# Altium schematic sheet 24Vto320V.SchDoc
size 863 x 558 mm; SheetNumber: 2; SheetTotal: 3
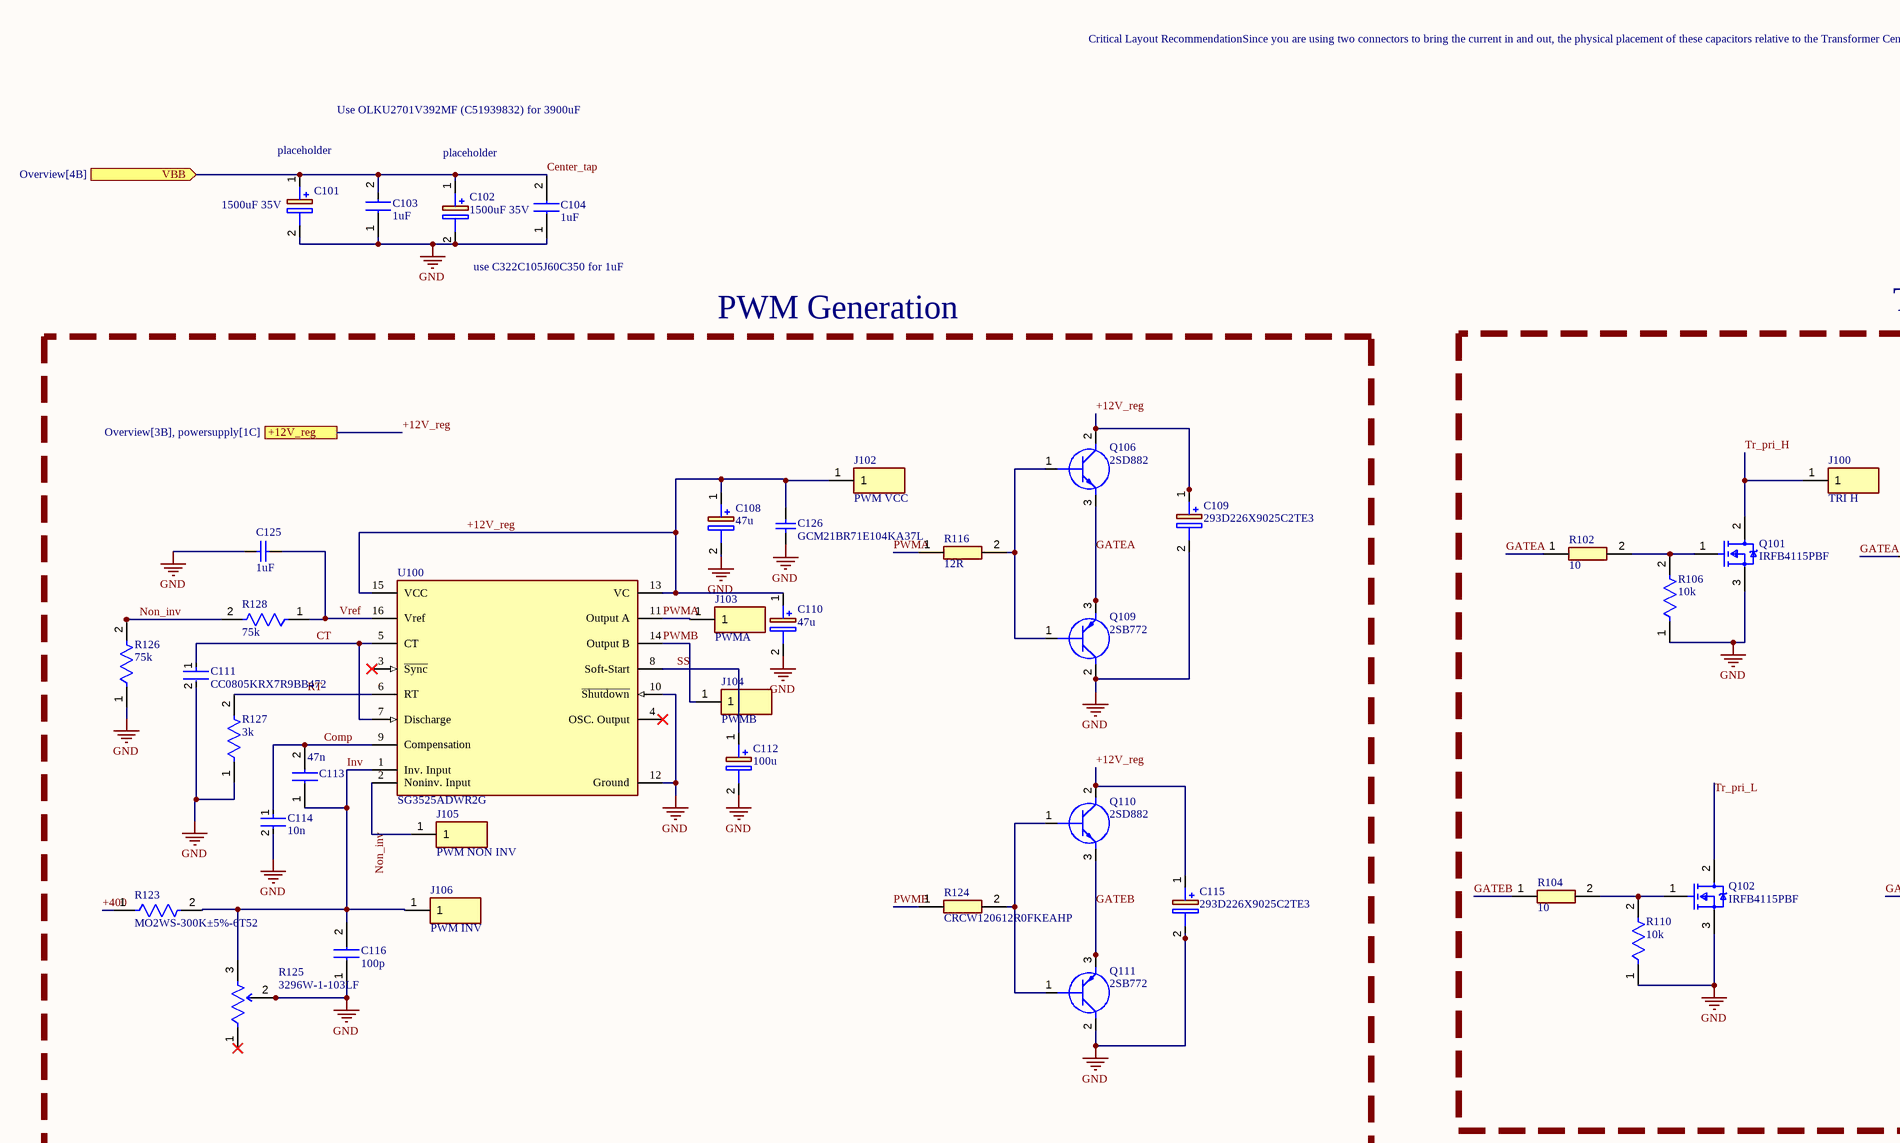
[diagram p0: 24Vto320V.SchDoc, top left]
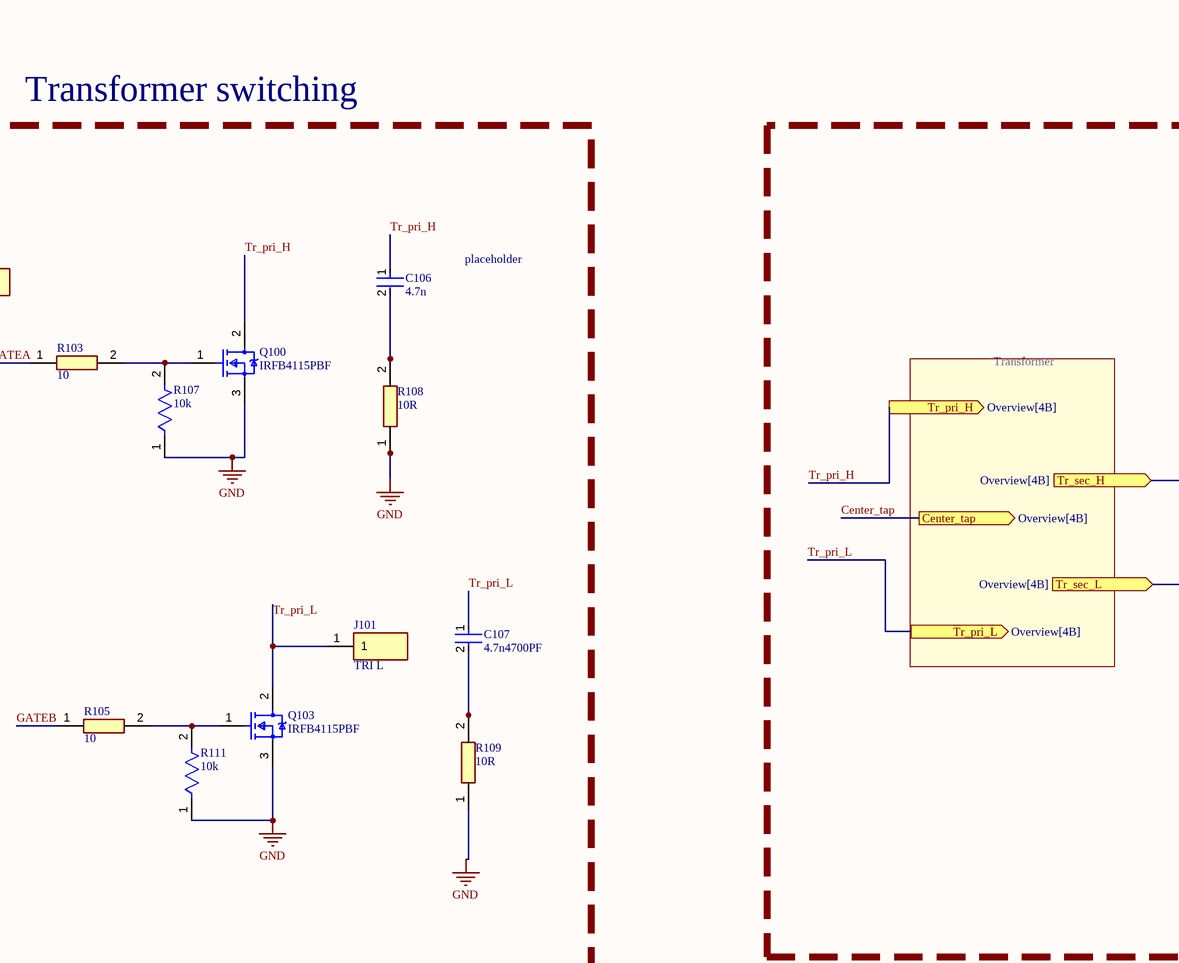
[diagram p1: 24Vto320V.SchDoc, top middle]
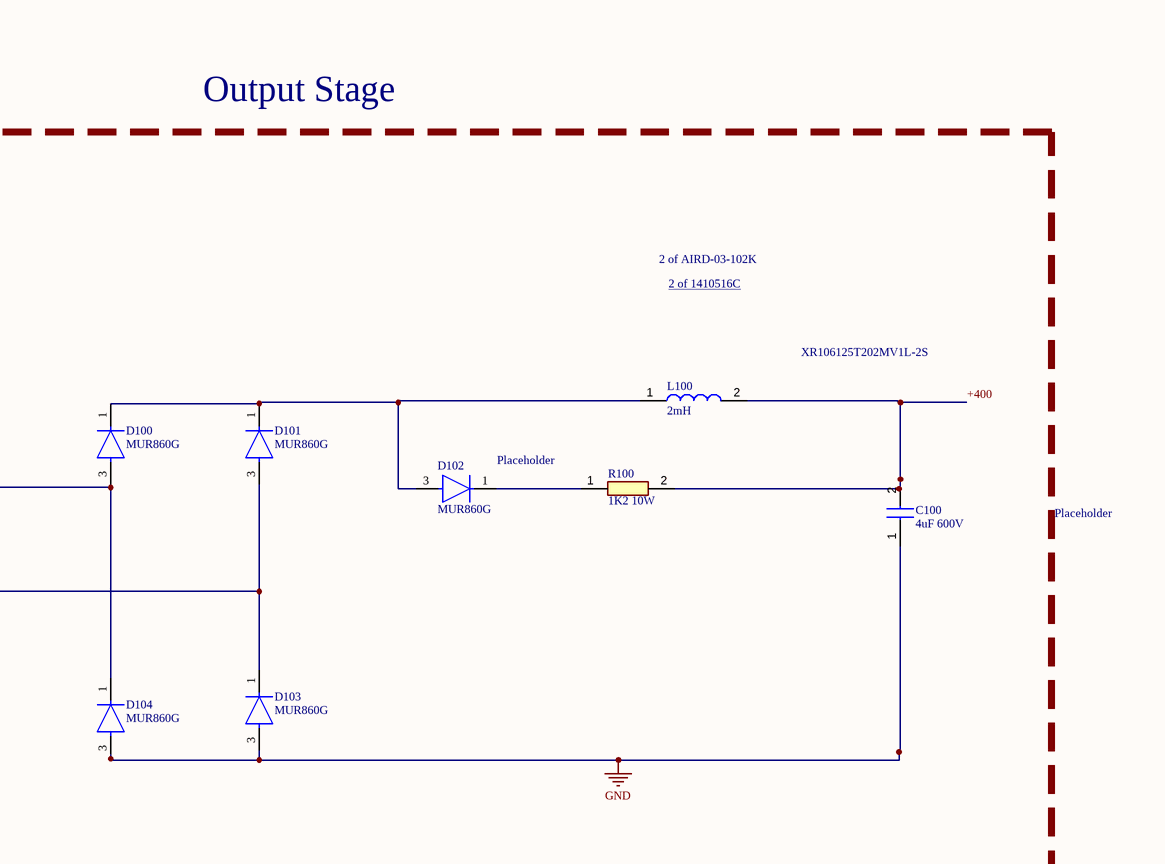
[diagram p2: 24Vto320V.SchDoc, top right]
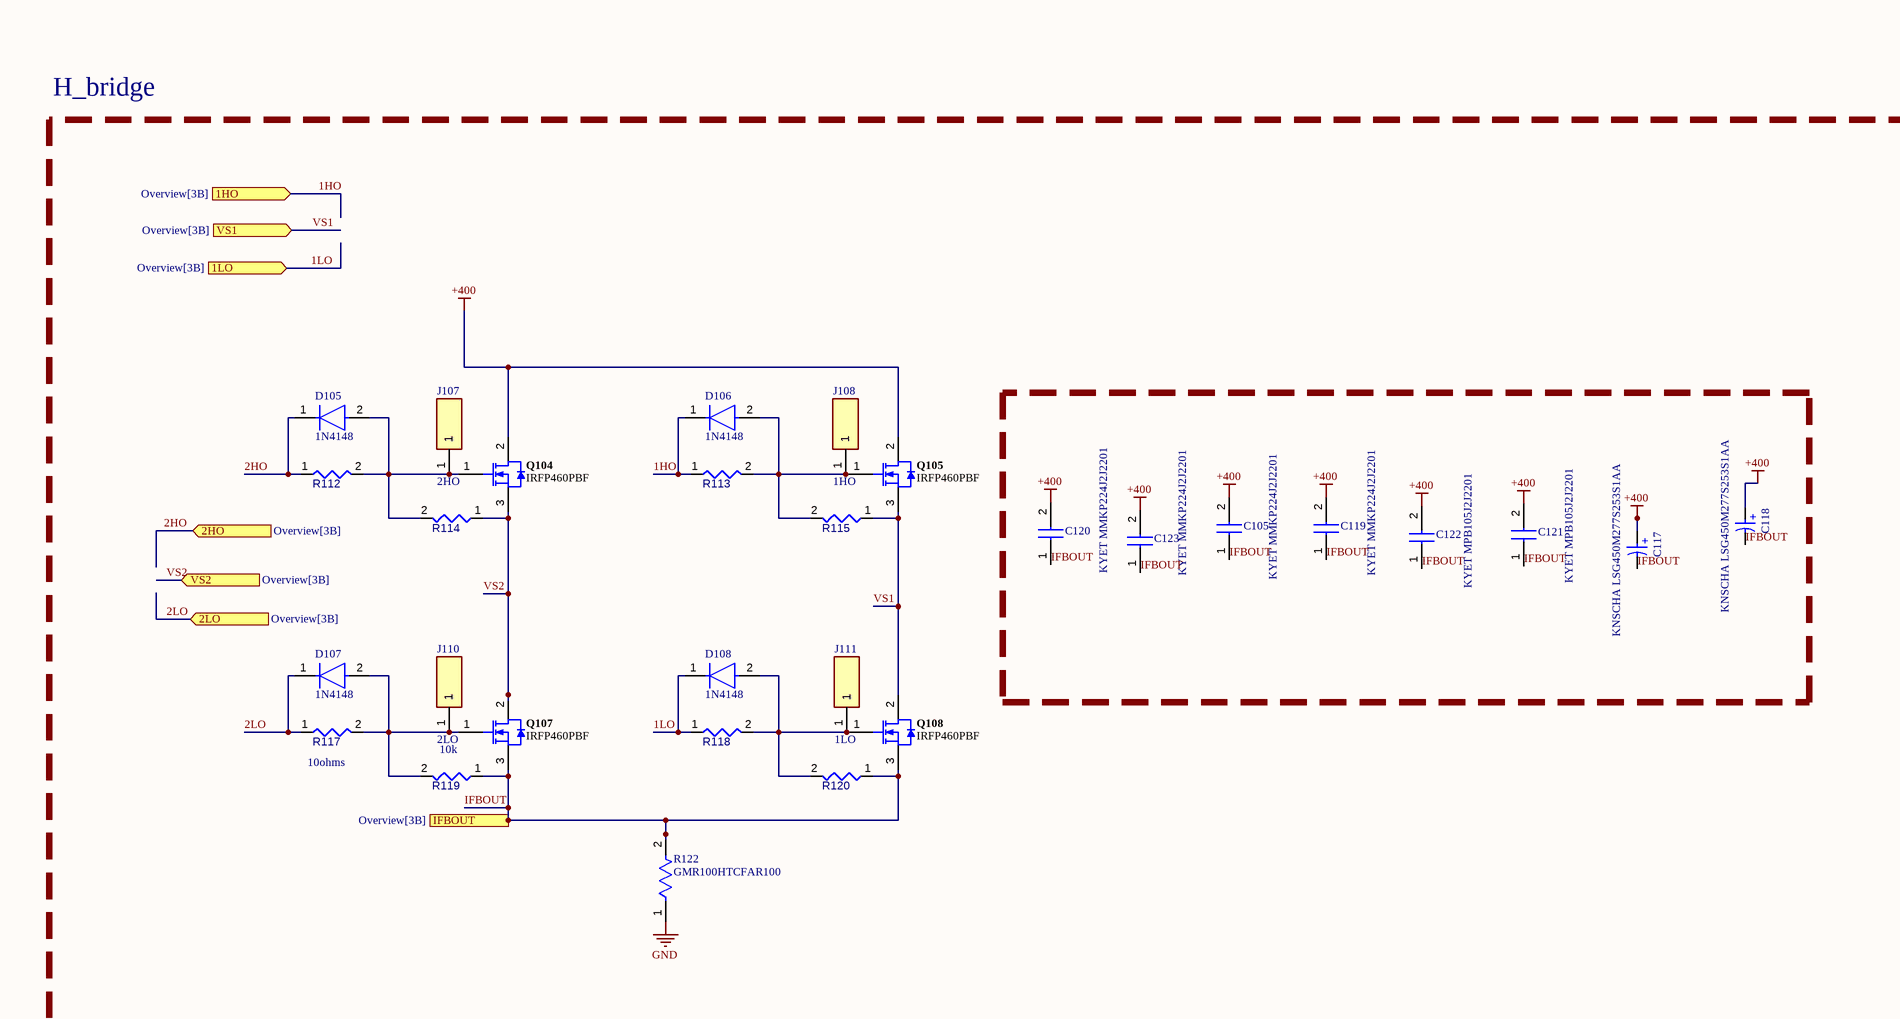
[diagram p3: 24Vto320V.SchDoc, bottom left]
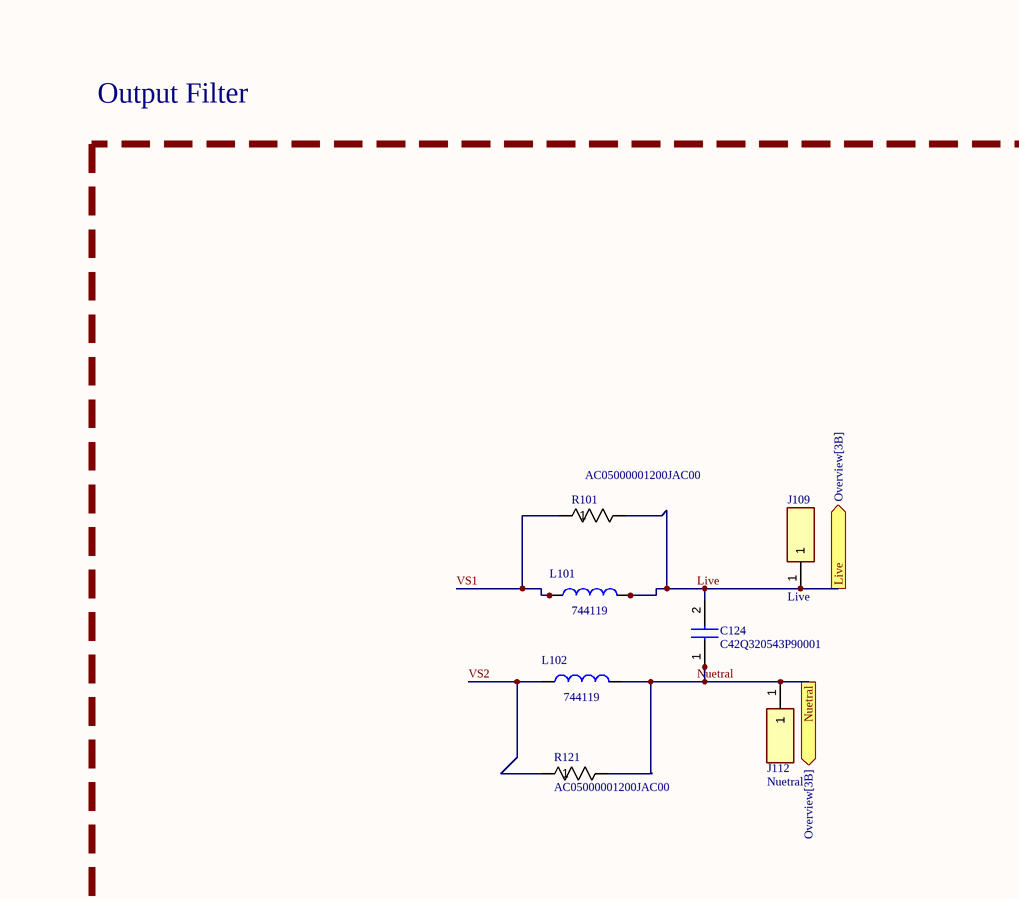
[diagram p4: 24Vto320V.SchDoc, bottom middle]

## Parts
C100  4uF 600V  [ECWFE2J225P5]
C101  1500uF 35V  [CAPPRD750W85D1800H2200]
C102  1500uF 35V  [CAPPRD750W85D1800H2200]
C103  1uF  [R75IN41004040J]
C104  1uF  [R75IN41004040J]
C105  KYET MMKP224J2J2201  [222233915224]
C106  4.7n  [FP-C1206C-EB-MFG]
C107  4.7n4700PF  [FP-C1206C-EB-MFG]
C108  47u  [CAPPRD250W55D655H1220]
C109  293D226X9025C2TE3  [CAPPM6032X280N]
C110  47u  [CAPPRD250W55D655H1220]
C111  CC0805KRX7R9BB472  [FP-CC0805-0_85-MFG]
C112  100u  [EEE0JA331XP]
C113  47n  [CAPC2012X145N]
C114  10n  [FP-CC0805-0_85-MFG]
C115  293D226X9025C2TE3  [CAPPM6032X280N]
C116  100p  [CAPC3216X88N]
C117  KNSCHA LSG450M277S253S1AA  [WCAP-AIG8_D30H30]
C118  KNSCHA LSG450M277S253S1AA  [WCAP-AIG8_D30H30]
C119  KYET MMKP224J2J2201  [222233915224]
C120  KYET MMKP224J2J2201  [222233915224]
C121  KYET MPB105J2J2201  [222233915224]
C122  KYET MPB105J2J2201  [222233915224]
C123  KYET MMKP224J2J2201  [222233915224]
C124  C42Q320543P90001  [222233915224]
C125  1uF  [CAPC2013X140X50LL20T25]
C126  GCM21BR71E104KA37L  [CAPC2013X140X45LL15T25]
D100  MUR860G  [FP-221B-04-MFG]
D101  MUR860G  [FP-221B-04-MFG]
D102  MUR860G  [FP-221B-04-MFG]
D103  MUR860G  [FP-221B-04-MFG]
D104  MUR860G  [FP-221B-04-MFG]
D105  1N4148  [FP-017AG-MFG]
D106  1N4148  [FP-017AG-MFG]
D107  1N4148  [FP-017AG-MFG]
D108  1N4148  [FP-017AG-MFG]
J100  TRI H  [5000]
J101  TRI L  [5000]
J102  PWM VCC  [5000]
J103  PWMA  [5000]
J104  PWMB  [5000]
J105  PWM NON INV  [5000]
J106  PWM INV  [5000]
J107  2HO  [5000]
J108  1HO  [5000]
J109  Live  [5000]
J110  2LO  [5000]
J111  1LO  [5000]
J112  Nuetral  [5000]
L100  2mH  [2300LL102VRC]
L101  744119  [744119]
L102  744119  [744119]
Q100  IRFB4115PBF  [FP-PG-TO220-3-MFG]
Q101  IRFB4115PBF  [FP-PG-TO220-3-MFG]
Q102  IRFB4115PBF  [FP-PG-TO220-3-MFG]
Q103  IRFB4115PBF  [FP-PG-TO220-3-MFG]
Q104  IRFP460PBF  [VISH-TO-247AC-3]
Q105  IRFP460PBF  [VISH-TO-247AC-3]
Q106  2SD882  [BD235]
Q107  IRFP460PBF  [VISH-TO-247AC-3]
Q108  IRFP460PBF  [VISH-TO-247AC-3]
Q109  2SB772  [TO229P290X760X1320-3P]
Q110  2SD882  [BD235]
Q111  2SB772  [TO229P290X760X1320-3P]
R100  1K2 10W  [SQP10AJB100R]
R101  AC05000001200JAC00  [RES_AC05_VIS]
R102  10  [RESC3216X60N]
R103  10  [RESC3216X60N]
R104  10  [RESC3216X60N]
R105  10  [RESC3216X60N]
R106  10k  [FP-CRCW0805-e3-IPC_A]
R107  10k  [FP-CRCW0805-e3-IPC_A]
R108  10R  [RESC6332X70N]
R109  10R  [RESC6332X70N]
R110  10k  [FP-CRCW0805-e3-IPC_A]
R111  10k  [FP-CRCW0805-e3-IPC_A]
R112  4.7 Ohm  [RESC0805(2012)_L]  (value not drawn)
R113  4.7 Ohm  [RESC0805(2012)_L]  (value not drawn)
R114  Resistor 10k +/-1% 0805 125 mW  [RESC2013X50X35ML15T15]  (value not drawn)
R115  Resistor 10k +/-1% 0805 125 mW  [RESC2013X50X35ML15T15]  (value not drawn)
R116  12R  [RESC3116X65N]
R117  4.7 Ohm  [RESC0805(2012)_L]  (value not drawn)
R118  4.7 Ohm  [RESC0805(2012)_L]  (value not drawn)
R119  Resistor 10k +/-1% 0805 125 mW  [RESC2013X50X35ML15T15]  (value not drawn)
R120  Resistor 10k +/-1% 0805 125 mW  [RESC2013X50X35ML15T15]  (value not drawn)
R121  AC05000001200JAC00  [RES_AC05_VIS]
R122  GMR100HTCFAR100  [FP-GMR100-MFG]
R123  MO2WS-300K±5%-6T52  [FP-VR37-MFG]
R124  CRCW120612R0FKEAHP  [RESC3116X65N]
R125  3296W-1-103LF  [FP-3296W-MFG]
R126  75k  [FP-CRCW0805-e3-IPC_A]
R127  3k  [FP-CRCW0805-e3-IPC_C]
R128  75k  [FP-CRCW0805-e3-IPC_A]
U100  SG3525ADWR2G  [FP-751G-MFG]

## Blocks framed on the sheet
PWM Generation: C108-C116 C125 C126 J102-J106 Q106 Q109-Q111 R116 R123-R128 U100
Transformer switching: C106 C107 J100 J101 Q100-Q103 R102-R111
H_bridge: C105 C117-C123 D105-D108 J107 J108 J110 J111 Q104 Q105 Q107 Q108 R112-R115 R117-R120 R122

## Ports
1HO (in, see Overview[3B]), 1LO (in, see Overview[3B]), 2HO (in, see Overview[3B]), 2LO (in, see Overview[3B]), +12V_reg (see Overview[3B], powersupply[1C]), Center_tap (out, see Overview[4B]), IFBOUT (out, see Overview[3B]), Live (out, see Overview[3B]), Nuetral (out, see Overview[3B]), Tr_pri_H (out, see Overview[4B]), Tr_pri_L (out, see Overview[4B]), Tr_sec_H (in, see Overview[4B]), Tr_sec_L (in, see Overview[4B]), VBB (in, see Overview[4B]), VS1 (in, see Overview[3B]), VS2 (in, see Overview[3B])

## Nets
+400: C100.2 C105.2 C117.1(P) C118.1(P) C119.2 C120.2 C121.2 C122.2 C123.2 L100.2 Q104.2(D) Q105.2(D) R100.2 R123.1
GND: C100.1 C101.2(-) C102.2(-) C103.1 C104.1 C108.2(-) C109.2(-) C110.2(-) C111.2 C112.2(-) C114.2 C115.2(-) C116.1 C125.2 C126.1 D103.3(A) D104.3(A) Q100.3(S) Q101.3(S) Q102.3(S) Q103.3(S) Q109.2(C) Q111.2(C) R106.1 R107.1 R108.1 R109.1 R110.1 R111.1 R122.1 R125.2(WIPER) R126.1 R127.1 U100.10(~{Shutdown}) U100.12(Ground)
1HO: D106.1(C) R113.1 ; port 1HO
1LO: D108.1(C) R118.1 ; port 1LO
2HO: D105.1(C) R112.1 ; port 2HO
2LO: D107.1(C) R117.1 ; port 2LO
+12V_reg: C108.1(+) C109.1(+) C110.1(+) C115.1(+) C126.2 J102.1 Q106.2(C) Q110.2(C) U100.13(VC) U100.15(VCC) ; port +12V_reg
Center_tap: C101.1(+) C102.1(+) C103.2 C104.2 ; port VBB, port Center_tap
Comp: C113.2 C114.1 U100.9(Compensation)
CT: C111.1 U100.5(CT) U100.7(Discharge)
GATEA: Q106.3(E) Q109.3(E) R102.1 R103.1
GATEB: Q110.3(E) Q111.3(E) R104.1 R105.1
IFBOUT: C105.1 C117.2(N) C118.2(N) C119.1 C120.1 C121.1 C122.1 C123.1 Q107.3(S) Q108.3(S) R119.1 R120.1 R122.2 ; port IFBOUT
Inv: C113.1 C116.2 J106.1 R123.2 R125.3(CW) U100.1(Inv._Input)
Live: C124.2 J109.1 L101.2 R101.2 ; port Live
Non_inv: J105.1 R126.2 R128.2 U100.2(Noninv._Input)
Nuetral: C124.1 J112.1 L102.2 R121.2 ; port Nuetral
PWMA: J103.1 R116.1 U100.11(Output_A)
PWMB: J104.1 R124.1 U100.14(Output_B)
RT: R127.2 U100.6(RT)
SS: C112.1(+) U100.8(Soft-Start)
Tr_pri_H: C106.1 J100.1 Q100.2(D) Q101.2(D) ; port Tr_pri_H
Tr_pri_L: C107.1 J101.1 Q102.2(D) Q103.2(D) ; port Tr_pri_L
Tr_sec_H: D100.3(A) D104.1(C) ; port Tr_sec_H
Tr_sec_L: D101.3(A) D103.1(C) ; port Tr_sec_L
Vref: C125.1 R128.1 U100.16(Vref)
VS1: L101.1 Q105.3(S) Q108.2(D) R101.1 R115.1 ; port VS1
VS2: L102.1 Q104.3(S) Q107.2(D) R114.1 R121.1 ; port VS2
NetC106_2: C106.2 R108.2
NetC107_2: C107.2 R109.2
NetD100_1: D100.1(C) D101.1(C) D102.3(A) L100.1
NetD102_1: D102.1(C) R100.1
NetD105_2: D105.2(A) J107.1 Q104.1(G) R112.2 R114.2
NetD106_2: D106.2(A) J108.1 Q105.1(G) R113.2 R115.2
NetD107_2: D107.2(A) J110.1 Q107.1(G) R117.2 R119.2
NetD108_2: D108.2(A) J111.1 Q108.1(G) R118.2 R120.2
NetQ100_1: Q100.1(G) R103.2 R107.2
NetQ101_1: Q101.1(G) R102.2 R106.2
NetQ102_1: Q102.1(G) R104.2 R110.2
NetQ103_1: Q103.1(G) R105.2 R111.2
NetQ106_1: Q106.1(B) Q109.1(B) R116.2
NetQ110_1: Q110.1(B) Q111.1(B) R124.2

Not connected (* = marked no-connect by the designer): R125 1(CCW)*; U100 3(~{Sync})* 4(OSC._Output)*

## Notes on the sheet
- Critical Layout RecommendationSince you are using two connectors to bring the current in and out, the physical placement of these capacitors relative to the Transformer Center Tap and the MOSFET Sources is everything.1. The "Star" ConnectionDo not just connect the ground of these capacitors to a random spot on the board.Positive Side: Place the capacitors as close as possible to the +12V pins of your 38969-0002 connector.Negative Side: The ground lead of these capacitors should be the central "Star Ground" point. The Sources of your push-pull MOSFETs should connect directly to this point with the widest possible traces.2. High-Frequency Cap PlacementWhile the $3900\mu\text{F}$ caps can be a few centimeters away, the $1\mu\text{F}$ capacitors (C103, C104) should be soldered as close to the MOSFET Drains and the Transformer Center Tap as humanly possible. This minimizes the loop area, which reduces the voltage spikes that can kill your MOSFETs.What’s Missing? (Recommendations)To make this 500W setup truly robust, consider these two additions:Small Ceramic Caps ($100\text{nF}$): Add a $100\text{nF}$ (0.1$\mu\text{F}$) X7R ceramic capacitor in parallel with each $1\mu\text{F}$ cap. Ceramics have even lower ESL and handle the nanosecond-scale ringing better than film caps.Fuse: At 500W from 12V, you are pulling over 40A. A 60A automotive bolt-down fuse (MIDI or MEGA fuse) should be placed between the battery and $V_{BB}$. If a MOSFET fails short-circuit (which is common during testing), your traces will vaporize without a fuse.Pro-tip for your EE55 build: Since you mentioned the transformer is external, the inductance of the wires connecting to the center tap will fight the capacitors. Try to keep the $V_{BB}$ line and the Ground line twisted together as they travel to the transformer to minimize that "stray" inductance.
- Use OLKU2701V392MF (C51939832) for 3900uF
- (near C101) placeholder
- (near C102) placeholder
- use C322C105J60C350 for 1uF
- Output Stage
- placeholder
- 2 of AIRD-03-102K
- 2 of 1410516C <https://www.mouser.com/datasheet/3/76/3/kmp_1400.pdf>
- XR106125T202MV1L-2S
- Transformer
- Placeholder
- Output Filter
- (near R117) 10ohms
- 10k
- DWG. NO.
- REV.
- SHT.
- REVISION
- DESCRIPTION
- DATE
- APPROVED
- THIS DOCUMENT AND THE DATA DISCLOSED HEREIN OR HEREWITH IS THE PROPERTY OF ALTIUM LIMITED AND MAY BE FREELY DISTRIBUTED IN WHOLE. NO RIGHTS ARE RESERVED OR EXPRESS OR IMPLIED WARANTEE GIVEN.
- ENG:
- DSN:
- APPROVALS
- PROJECT
- DOCUMENT REVISION:
- DESIGN ITEM:
- CHK:
- BOM:
- REFERENCE DOCUMENTS
- PROJECT REVISION:
- TITLE
- FAB DWG:
- PCB DWG:
- ASSY DWG:
- SCALE:
- SIZE
- D
- CAGE CODE
- FILE NAME
- DWG NO.
- SHEET
- OF
- REV
- (in symbol CMP-03913-54202287-2) +

## Library data of the parts
C100 = ECW-FE2J225P5: C3D1U405KB00C00; Manufacturer_Name: Panasonic; Datasheet Link: https://industrial.panasonic.com/cdbs/www-data/pdf/RDI0000/ABD0000C202.pdf; Height: 23.5mm; Manufacturer_Part_Number: ECW-FE2J225P5
C101 C102 = EEU-FC1V152S: 35ZLH1500MEFC12.5X30; Manufacturer_Name: Panasonic; Datasheet Link: http://industrial.panasonic.com/cdbs/www-data/pdf/RDF0000/ABA0000C1209.pdf; Height: 22mm; Manufacturer_Part_Number: EEU-FC1V152S; Mouser Part Number: 667-EEU-FC1V152S; Mouser Price/Stock: https://www.mouser.com/Search/Refine.aspx?Keyword=667-EEU-FC1V152S; Arrow Part Number: EEU-FC1V152S; Arrow Price/Stock: https://www.arrow.com/en/products/eeu-fc1v152s/panasonic
C103 C104 = R75IN41004040J: C322C105J60C350; Manufacturer_Name: Yageo Group; Datasheet Link: https://www.yageogroup.com/content/datasheet/asset/file/KEM_F3106_R75; Height: 16mm; Manufacturer_Part_Number: R75IN41004040J; Mouser Part Number: 80-R75IN41004040J; Mouser Price/Stock: https://www.mouser.co.uk/ProductDetail/KEMET/R75IN41004040J?qs=pfd5qewlna63QSQqVCHX%2Fw%3D%3D
C105 C119 C120 C123 = 222233915224: 220nF Film Capacitor ±5% 630V Through Hole P=22.5mm; Manufacturer_Name: Vishay; Datasheet Link: https://www.vishay.com/docs/28138/mkp339x2.pdf; Height: 15.5mm; Manufacturer_Part_Number: 222233915224; Mouser Part Number: N/A; Mouser Price/Stock: https://www.mouser.co.uk/ProductDetail/Vishay-BC-Components/222233915224?qs=vkgpMzy1B9Fp9IMdtZOLlw%3D%3D
C106 C107 = CMP-03020-021254-1: CAP CER 4700PF 100V 10% X7R 1206 / CC1206KRX7R0BB472; Manufacturer Part Number: C1206C472K1RACTU; Manufacturer: KEMET; Value: 4,700 pF; Tolerance: 0.1; Temperature Coefficient: 15%; Material: Ceramic; Automotive Grade: Grade 0; ComponentLink2Description: Datasheet; Mouser Description: 1206 4.7nF Ceramic Multilayer Capacitor; 100V dc; 125C; X7R Dielectric; +/-10% SMD; Lead Free: Yes; Automotive: Yes; Category: Cap; Package: C1206C-EB; RoHS: TRUE; Digikey Description: CAP CER 4700PF 100V 10% X7R 1206; Ipc Land Pattern Name: CAPC320160X78; Voltage Rating: 100 V; Temperature Range High: +150°C; Temperature Characteristic: X7R; Octopart: https://octopart.com/c1206c472k1ractu-kemet-3865440; Temperature: -55°C to +150°C; Device Class L2: Capacitors; Device Class L3: Ceramic Capacitors; ComponentLink2URL: https://content.kemet.com/datasheets/KEM_C1007_X8R_ULTRA_150C_SMD.pdf; Capacitance: 4,700 pF; Temperature Range Low: -55°C; Device Class L1: Passive Components; Height: 0.88mm
C108 C110 = EEU-FC1V470: Manufacturer_Name: Panasonic; Datasheet Link: http://industrial.panasonic.com/cdbs/www-data/pdf/RDF0000/ABA0000C1209.pdf; Height: 12.2mm; Manufacturer_Part_Number: EEU-FC1V470; Mouser Part Number: 667-EEU-FC1V470; Mouser Price/Stock: https://www.mouser.co.uk/ProductDetail/Panasonic/EEU-FC1V470?qs=LcHzz5wiUnXQHudKE6FiUA%3D%3D; Arrow Part Number: EEU-FC1V470; Arrow Price/Stock: https://www.arrow.com/en/products/eeu-fc1v470/panasonic?region=nac
C109 C115 = 293D226X9025C2TE3: Capacitor Polarised; Manufacturer_Name: Vishay; Datasheet Link: http://www.vishay.com/docs/40002/293d.pdf; Height: 2.8mm; Manufacturer_Part_Number: 293D226X9025C2TE3; Mouser Part Number: 74-293D226X9025C2TE3; Mouser Price/Stock: https://www.mouser.co.uk/ProductDetail/Vishay-Sprague/293D226X9025C2TE3?qs=dG4nGvFc7P9WRSkI1DdLhQ%3D%3D; Arrow Part Number: 293D226X9025C2TE3; Arrow Price/Stock: https://www.arrow.com/en/products/293d226x9025c2te3/vishay?utm_currency=USD&region=nac
C111 = CMP-1036-03591-2: CAP CER 4700PF 50V X7R 0805; Manufacturer: Yageo; Tolerance: 0.1; Capacitance: 4.7 nF; Value: 4.7 nF; Material: Ceramic; Device Class L1: Passive Components; Voltage Rating: 50 V; ComponentLink2URL: http://www.yageo.com/documents/recent/UPY-GPHC_Y5V_6.3V-to-50V_8.pdf; Device Class L3: Ceramic Capacitors; Temperature: -30°C to +85°C; Height: 0.95mm; Package: CC0805-0.85; Digikey Description: CAP CER 4700PF 50V X7R 0805; Ipc Land Pattern Name: CAPC200125X85; Device Class L2: Capacitors; Temperature Range High: +85°C; Mouser Description: Multilayer Ceramic Capacitors MLCC - SMD/SMT 4.7nF 50V X7R 10%; Lead Free: Yes; Manufacturer Part Number: CC0805KRX7R9BB472; Category: Cap; Temperature Range Low: -30°C; Octopart: https://octopart.com/cc0805krx7r9bb472-yageo-192986; Automotive: No; RoHS: TRUE; Temperature Characteristic: X7R; ComponentLink2Description: Datasheet; Footprint Url: http://www.yageo.com/exep/pages/download/literatures/UPY-C_GEN_24.pdf
C112 = EEE-1VA101XP: Manufacturer_Name: Panasonic; Datasheet Link: http://industrial.panasonic.com/cdbs/www-data/pdf/RDE0000/ABA0000C1145.pdf; Height: 7.8mm; Manufacturer_Part_Number: EEE-1VA101XP; Mouser Part Number: 667-EEE-1VA101XP; Mouser Price/Stock: https://www.mouser.co.uk/ProductDetail/Panasonic/EEE-1VA101XP?qs=wEytwf7f49FM0EqQXrBRGQ%3D%3D; Arrow Part Number: EEE-1VA101XP; Arrow Price/Stock: https://www.arrow.com/en/products/eee-1va101xp/panasonic?region=europe
C113 = GRM21BR71H473KA01L: Manufacturer_Name: Murata Electronics; Datasheet Link: https://search.murata.co.jp/Ceramy/image/img/A01X/G101/ENG/GRM21BR71H473KA01-01.pdf; Height: 1.45mm; Manufacturer_Part_Number: GRM21BR71H473KA01L; Mouser Part Number: 81-GRM40X473K50L; Mouser Price/Stock: https://www.mouser.co.uk/ProductDetail/Murata-Electronics/GRM21BR71H473KA01L?qs=sMEX%2F0vXHgl0Nq00%252BwNcXQ%3D%3D; Arrow Part Number: GRM21BR71H473KA01L; Arrow Price/Stock: https://www.arrow.com/en/products/grm21br71h473ka01l/murata-manufacturing?region=europe
C114 = CMP-1036-03842-3: CAP CER 10000PF 50V X7R 0805 / CC0805KRX7R9BB103; Manufacturer: Yageo; Capacitance: 10 nF; Material: Ceramic; Value: 10 nF; Tolerance: 0.1; Footprint Url: http://www.yageo.com/exep/pages/download/literatures/UPY-C_GEN_24.pdf; Temperature Characteristic: X7R; ComponentLink2Description: Datasheet; Lead Free: Yes; Height: 0.95mm; Temperature Range High: +85°C; Automotive: No; Octopart: https://octopart.com/cc0805krx7r9bb103-yageo-192989; Device Class L1: Passive Components; Mouser Description: Multilayer Ceramic Capacitors MLCC - SMD/SMT 10nF 50V X7R 10%; Temperature: -30°C to +85°C; Device Class L2: Capacitors; Ipc Land Pattern Name: CAPC200125X85; Device Class L3: Ceramic Capacitors; Temperature Range Low: -30°C; RoHS: TRUE; Manufacturer Part Number: CC0805KRX7R9BB103; Voltage Rating: 50 V; Package: CC0805-0.85; Category: Cap; ComponentLink2URL: http://www.yageo.com/documents/recent/UPY-GPHC_Y5V_6.3V-to-50V_8.pdf; Digikey Description: CAP CER 10000PF 50V X7R 0805
C116 = C1206C101J5GACTU7990: Manufacturer_Name: Yageo Group; Datasheet Link: https://www.kemet.com/specsheet/C1206C101J5GACTU; Height: 0.88mm; Manufacturer_Part_Number: C1206C101J5GACTU7990; Arrow Part Number: C1206C101J5GACTU7990; Arrow Price/Stock: https://www.arrow.com/en/products/c1206c101j5gactu7990/kemet-corporation
C117 C118 = CMP-03913-54202287-2: 270uF ±20% 450V Aluminum Electrolytic Capacitors Through Hole,D30xL25mm; Life (Hours): 2000hours; ESR (Equivalent Series Resistance): 580.56mΩ; Capacitance: 150µF; Leakage Current: 1.35mA; Pitch: 10mm; Polarity: Polar; Ripple Current: 1.39A; Voltage Rating: 450V; Max Operating Temperature: 85°C; RoHS: Compliant; Height: 31mm; Height - Seated (Max): 32.9946mm; Mount: Through Hole; Lead Pitch: 10.0076mm; Min Operating Temperature: -25°C; Voltage Rating (DC): 450V; Length: 31mm; Diameter: 30mm; Case/Package: Radial; REACH SVHC: Unknown; Tolerance: 20%
C121 C122 = 222233915224: 1uF Film Capacitor ±5% 630V Through Hole P=22.5mm; Manufacturer_Name: Vishay; Datasheet Link: https://www.vishay.com/docs/28138/mkp339x2.pdf; Height: 15.5mm; Manufacturer_Part_Number: 222233915224; Mouser Part Number: N/A; Mouser Price/Stock: https://www.mouser.co.uk/ProductDetail/Vishay-BC-Components/222233915224?qs=vkgpMzy1B9Fp9IMdtZOLlw%3D%3D
C124 = 222233915224: 2uF ±10% 275V 310V Safety Capacitor X2 Through Hole,P=22.5mm; Manufacturer_Name: Vishay; Datasheet Link: https://www.vishay.com/docs/28138/mkp339x2.pdf; Height: 15.5mm; Manufacturer_Part_Number: 222233915224; Mouser Part Number: N/A; Mouser Price/Stock: https://www.mouser.co.uk/ProductDetail/Vishay-BC-Components/222233915224?qs=vkgpMzy1B9Fp9IMdtZOLlw%3D%3D
C125 = CMP-2007-03234-1: C0805C105K3RACTU; Manufacturer: Kemet; Part Number: C0805C105K3RACTU
C126 = CMP-2007-03344-1: Manufacturer: Murata; Part Number: GCM21BR71E104KA37L
D100-D104 = CMP-0902-00354-3: NexarPartId: 120366; Manufacturer Lifecycle Status: ACTIVE; Peak Reverse Current: 10µA; Output Current: 8A; Voltage Rating (DC): 600V; Polarity: Standard; Reverse Recovery Time: 60ns; Peak Non-Repetitive Surge Current: 100A; Element Configuration: Single; Forward Voltage: 1.5V; Contact Plating: Tin; Lead Free: Lead Free; Width: 4.82mm; Min Operating Temperature: -65°C; REACH SVHC: No SVHC; Max Repetitive Reverse Voltage (Vrrm): 600V; RoHS: Compliant; Length: 10.29mm; Weight: 4.535924g; Height: 9.27mm; Max Forward Surge Current (Ifsm): 100A; Lifecycle Status: Production; Radiation Hardening: No; Max Surge Current: 100A; Case/Package: TO-220-2; Reverse Voltage: 600V; Current Rating: 8A; Breakdown Voltage: 600V; Schedule B: 8541100080, 8541100080; Max Reverse Voltage (DC): 600V; Forward Current: 8A; Average Rectified Current: 8A; Recovery Time: 60ns; Number of Pins: 2; Max Operating Temperature: 175°C
D105-D108 = CMP-07163-000046-1: DIODE GEN PURP 100V 200MA DO35; Forward Voltage: 1V; Max Power Dissipation: 500mW; Max Reverse Current: 5uA; Forward Current: 300mA; Current: 4A; Reverse Recovery Time: 4ns; Element Configuration: Single; Outside Diameter: 1.85mm; Capacitance: 4pF; Polarity: Standard; Max Forward Surge Current (Ifsm): 1A; Reverse Voltage: 100V; Output Current: 200mA; Average Rectified Current: 200mA; Diameter: 1.91mm; Max Repetitive Reverse Voltage (Vrrm): 100V; Current Rating: 200mA; Case/Package: DO-35; Lead Free: Lead Free; Number of Pins: 2; Recovery Time: 4ns; Packaging: Bulk; Contact Plating: Tin; Voltage: 100V; Mount: Through Hole; Max Surge Current: 4A; Package Quantity: 2000; Width: 1.91mm; Max Reverse Voltage (DC): 100V; Length: 4.56mm; Radiation Hardening: No; Power Dissipation: 500mW; Voltage Rating (DC): 100V; Peak Non-Repetitive Surge Current: 4A; REACH SVHC: No SVHC; Height: 4.56mm; Max Operating Temperature: 175°C; Series: -; Weight: 0.01lb; Min Operating Temperature: -65°C
J100-J112 = 5000: Connector; Manufacturer_Name: Keystone Electronics; Datasheet Link: http://www.keyelco.com/product-pdf.cfm?p=1309; Manufacturer_Part_Number: 5000; Mouser Part Number: 534-5000; Mouser Price/Stock: https://www.mouser.co.uk/ProductDetail/Keystone-Electronics/5000?qs=q0tsjPZWdm%252B9SiiTAbEwUw%3D%3D; Arrow Part Number: 5000; Arrow Price/Stock: https://www.arrow.com/en/products/5000/keystone-electronics.html?utm_currency=USD&region=europe
L100 = 2300LL-102-V-RC: XR106125T202MV1L-2S; Manufacturer_Name: Bourns; Datasheet Link: https://www.mouser.com/datasheet/2/54/2300ll_series-776387.pdf; Height: 32.512mm; Manufacturer_Part_Number: 2300LL-102-V-RC; Mouser Part Number: 652-2300LL-102-V-RC; Mouser Price/Stock: https://www.mouser.co.uk/ProductDetail/Bourns/2300LL-102-V-RC?qs=d7g9p1yFhWZHzfawXthNnQ%3D%3D; Arrow Part Number: 2300LL-102-V-RC; Arrow Price/Stock: https://www.arrow.com/en/products/2300ll-102-v-rc/bourns?utm_currency=USD&region=nac
L101 L102 = CMP-03913-22803290-2: Toroidal Inductor, 890Uh, 2A, Tht Rohs Compliant: Yes; Shielding: Unshielded; Core Material: Ferrite; Pitch: 500µm; DC Resistance (DCR): 400mΩ; Inductance: 890µH; Max DC Current: 1A; Self Resonant Frequency: 850kHz; Test Frequency: 10kHz; Pin Length: 12mm; Saturation Current: 900mA; Tolerance: 20%; Termination: Through Hole; Ambient Temperature Range High: 65°C; Diameter: 30mm; Max Operating Temperature: 105°C; RoHS: Compliant; Series Resistance: 400mΩ; Ambient Temperature Range Low: -40°C; Mount: Through Hole, Wire; Current Rating: 2A; Height: 12mm; Depth: 14mm; Length: 30mm; Case/Package: Radial; Width: 14mm; Lead Pitch: 13mm; Packaging: Bulk; Min Operating Temperature: -40°C
Q100-Q103 = CMP-32901-000101-1: MOSFET N-CH 150V 104A TO220AB; Manufacturer: Infineon Technologies; Gate Charge At Vgs: 77nC @ 10V; Turn Off Delay Time: 41ns; Pulse Drain Current: 420A; Number Of N Channels: 1; Input Capacitace At Vds: 5270pF @ 50V; Reverse Recovery Charge: 300nC; Rthja Max: 62°C/W; Reverse Recovery Time: 86ns; Power Dissipation: 380W; Turn On Delay Time: 18ns; Drain To Source Resistance: 9.3mΩ; Threshold Vgs Min: 3V; Depletion Mode: False; Gate To Source Voltage: 20V; Max Junction Temp: +175°C; Standoff Height: 3.37mm; Threshold Vgs Max: 5V; Max Forward Diode Voltage: 1.3V; Temperature Range Low: -55°C; Octopart: https://octopart.com/irfb4115pbf-infineon-65873822; Lead Free: Yes; Height: 19.8mm; Digikey Description: MOSFET N-CH 150V 104A TO220AB; Continuous Drain Current: 104A; Device Class L3: MOSFETs; Number Of Channels: 1; Mouser Description: MOSFET Operating temperature: -55...+175 °C Housing type: TO-220 Polarity: N Power dissipation: 380 W; RoHS: TRUE; Temperature Range High: +175°C; Drain To Source Voltage: 150V; Category: Trans; Drain To Source Breakdown Voltage: 150V; ComponentLink2URL: https://www.infineon.com/dgdl/irfb4115pbf.pdf?fileId=5546d462533600a401535615ba6a1e0f; Package: PG-TO220-3; Footprint Url: https://www.infineon.com/dgdl/po-to220ab-fp.pdf?fileId=5546d462580663ef0158068cfbee01be; Device Class L1: Discrete Semiconductors; Manufacturer Part Number: IRFB4115PBF; Temperature: -55°C to +175°C; Ipc Land Pattern Name: TO-220; Automotive: No; Device Class L2: Transistors; ComponentLink2Description: Datasheet
Q104 Q105 Q107 Q108 = CMP-2000-06478-1: N-Channel Power MOSFET, 500 V, -55 to 150 degC, 3-Pin FM (TO-247), RoHS, Tube; Manufacturer: Vishay; Drain Source Voltage Vds: 500V; No. of Pins: 3Pins; On Resistance Rds(on): 0.27ohm; Transistor Polarity: NChannel; Power Dissipation Pd: 280W; Threshold Voltage Vgs: 4V; Transistor Case Style: TO-247AC; Continuous Drain Current Id: 20A; Rds(on) Test Voltage Vgs: 10V; SVHC: ToBeAdvised; Mounting Technology: ThroughHole; Automotive Qualification Standard: -; Datasheet Version: Rev. A, 07/2008; Package Reference: TO-247AC-3; Package Description: 3-Pin Flange Mount Package, Body 15.58 x 4.945 mm, Pitch 5.46 mm; Operating Temperature Max: 150°C; Product Range: -; Manufacturer URL: http://www.vishay.com/; MSL: -; Datasheet URL: https://datasheet.ciiva.com/17070/0900766b8079122f-17070730.pdf
Q106 Q110 = 2SD882: Transistor BJT NPN; Manufacturer_Name: STMicroelectronics; Datasheet Link: https://www.st.com/resource/en/datasheet/2sd882.pdf; Height: 2.9mm; Manufacturer_Part_Number: 2SD882; Mouser Part Number: 511-2SD882; Mouser Price/Stock: https://www.mouser.co.uk/ProductDetail/STMicroelectronics/2SD882?qs=48xh8PjiJp54c%2F0PmkMjUQ%3D%3D; Arrow Part Number: 2SD882; Arrow Price/Stock: https://www.arrow.com/en/products/2sd882/stmicroelectronics?utm_currency=USD&region=nac
Q109 Q111 = 2SB772: Transistor BJT PNP; Manufacturer_Name: STMicroelectronics; Datasheet Link: https://datasheet.datasheetarchive.com/originals/distributors/Datasheets-45/DSA-5248.pdf; Height: 2.9mm; Manufacturer_Part_Number: 2SB772; Mouser Part Number: 511-2SB772; Mouser Price/Stock: https://www.mouser.co.uk/ProductDetail/STMicroelectronics/2SB772?qs=7kmgJcyZw9d2sYv58XGrqg%3D%3D
R100 = SQP10AJB-1K2: Manufacturer_Name: Yageo Group; Datasheet Link: https://datasheet.datasheetarchive.com/originals/distributors/Datasheets_SAMA/93bf563c2b531d562506a92f6e9f509a.pdf; Height: 10mm; Manufacturer_Part_Number: SQP10AJB-1K2; Mouser Part Number: 603-SQP10AJB-1K2; Mouser Price/Stock: https://www.mouser.co.uk/ProductDetail/YAGEO/SQP10AJB-1K2?qs=KUIzHt%2Fe91lQt12IWbZ47A%3D%3D
R101 R121 = CMP-00030-42521983-1: AC05000001200JAC00 Resistor, 120 Ohm, ± 5%, 5 W, Axial Leaded, Wirewound, General Purpose; Voltage Rating: 24V; Resistance: 120Ω; Power Rating: 5W; Temperature Coefficient: -80ppm/°C; Lead Diameter: 800µm; Composition: Wirewound; Number of Pins: 2; Military Standard: Not; Features: Flame Retardant Coating; RoHS: Compliant; Lead Free: Lead Free; Min Operating Temperature: 0°C; Length: 18mm; Packaging: Tape & Box (TB); NexarPartId: 42521983; Voltage Rating (DC): 24V; Tolerance: 5%; Diameter: 7.5mm; REACH SVHC: Unknown; Radiation Hardening: No; Contact Plating: Tin; Max Operating Temperature: 275°C; Case/Package: Axial; Number of Terminations: 2; Termination: Axial; Width: 7.49mm; Schedule B: 8533210080, 8533210080; Max Power Dissipation: 5W
R102-R105 = CRCW120610R0FKEA: Manufacturer_Name: Vishay; Datasheet Link: http://www.vishay.com/docs/20035/dcrcwe3.pdf; Height: 0.6mm; Manufacturer_Part_Number: CRCW120610R0FKEA; Mouser Part Number: 71-CRCW1206-10-E3; Mouser Price/Stock: https://www.mouser.co.uk/ProductDetail/Vishay-Dale/CRCW120610R0FKEA?qs=ODaLBy2SlZEomzAFMQRuoA%3D%3D; Arrow Part Number: CRCW120610R0FKEA; Arrow Price/Stock: https://www.arrow.com/en/products/crcw120610r0fkea/vishay?utm_currency=USD&region=nac
R106 R107 R110 R111 = CMP-2001-04908-2: RES Thick Film, 10kΩ, 1%, 0.125W, 100ppm/°C, 0805, CRCW080510K0FKEA; Resistance: 10kR; Voltage Rating (DC): 150V; Power Rating: 125mW; Weight: 0.000194oz; Package Quantity: 5000; Military Standard: Not; Max Operating Temperature: 155°C; Temperature Coefficient: 100ppm/°C; Contact Plating: Tin; Width: 1.25mm; Height: 0.45mm; Radiation Hardening: No; Tolerance: 1%; Min Operating Temperature: -55°C; Voltage Rating: 150V; Length: 2mm; Depth: 1.25mm; Termination: SMD/SMT; Packaging: Tape and Reel; Case/Package: 0805; Case Code (Metric): 2012; Lead Free: Lead Free; Case Code (Imperial): 0805; Composition: Thick Film
R108 R109 = CRCW251210R0FKEG: Manufacturer_Name: Vishay; Datasheet Link: http://www.vishay.com/docs/20035/dcrcwe3.pdf; Height: 0.7mm; Manufacturer_Part_Number: CRCW251210R0FKEG; Mouser Part Number: 71-CRCW2512-10-E3; Mouser Price/Stock: https://www.mouser.co.uk/ProductDetail/Vishay-Dale/CRCW251210R0FKEG?qs=VTHkDwr%2FZpkb635FFTvRPg%3D%3D; Arrow Part Number: CRCW251210R0FKEG; Arrow Price/Stock: https://www.arrow.com/en/products/crcw251210r0fkeg/vishay?utm_currency=USD&region=nac
R112 R113 R117 R118 = CMP-009-00102-2: 4.7 Ohm 0.125W 5% 0805 (2012 Metric)  SMD; Power: 125mW; Value: 470; Mounting Technology: SMT; Case/Package: 0805; Pins: 2; Tolerance: 5%
R114 R115 R119 R120 = CMP-009-00018-5: Chip Resistor, 10 KOhm, +/- 1%, 125 mW, -55 to 155 degC, 0805 (2012 Metric); Power: 125mW; Voltage Rating: 150V; Mounting Technology: SM; Case/Package: 0805; Pins: 2; RoHS Compliant: True; Min Operating Temperature: -55°C; Max Operating Temperature: 155°C; Tolerance: 1%; Value: 10k
R116 = CRCW120612R0FKEAHP: Manufacturer_Name: Vishay; Datasheet Link: http://www.vishay.com/docs/20035/dcrcwe3.pdf; Height: 0.65mm; Manufacturer_Part_Number: CRCW120612R0FKEAHP; Mouser Part Number: 71-CRCW120612R0FKEAH; Mouser Price/Stock: https://www.mouser.co.uk/ProductDetail/Vishay-Dale/CRCW120612R0FKEAHP?qs=40TFAHZMFvfoWh3r5QltXA%3D%3D; Arrow Part Number: CRCW120612R0FKEAHP; Arrow Price/Stock: https://www.arrow.com/en/products/crcw120612r0fkeahp/vishay?region=nac
R122 = CMP-08839-031888-1: RES 0.1 OHM 1% 7W 2512; Resistance: 100mR; Max Power Dissipation: 3W; Temperature Coefficient: 20ppm/°C; Case Code (Imperial): 2512; Case Code (Metric): 6432; Tolerance: 1%; Packaging: Cut Tape; Case/Package: 2512; Min Operating Temperature: -55°C; Max Operating Temperature: 170°C; Number of Terminations: 2; Resistor Type: Metal Element; Features: Automotive AEC-Q200
R123 = CMP-02408-000054-1: RES 300k OHM 5% 1/2W AXIAL; Voltage Rating: 3.5kV; Power Rating: 500mW; Temperature Coefficient: 200ppm/°C; Resistance: 1.2MR; Diameter: 4mm; Max Operating Temperature: 155°C; Military Standard: Not; Reach SVHC Compliant: Yes; Min Operating Temperature: -55°C; Resistance Tolerance: 5%; Resistor Type: Metal Film; Tolerance: 5%; Mount: Through Hole; Construction: Cylindrical; Contact Plating: Tin; Length: 10mm; Termination: Axial; Voltage Rating (DC): 3.5kV; Packaging: Ammo Pack; Radiation Hardening: No; Case/Package: Conformal
R124 = CRCW120612R0FKEAHP: Resistor; Manufacturer_Name: Vishay; Datasheet Link: http://www.vishay.com/docs/20035/dcrcwe3.pdf; Height: 0.65mm; Manufacturer_Part_Number: CRCW120612R0FKEAHP; Mouser Part Number: 71-CRCW120612R0FKEAH; Mouser Price/Stock: https://www.mouser.co.uk/ProductDetail/Vishay-Dale/CRCW120612R0FKEAHP?qs=40TFAHZMFvfoWh3r5QltXA%3D%3D; Arrow Part Number: CRCW120612R0FKEAHP; Arrow Price/Stock: https://www.arrow.com/en/products/crcw120612r0fkeahp/vishay?region=nac
R125 = CMP-1747-00001-8: TRIMMER 10K OHM 0.5W PC PIN TOP; Number of Turns: 25; Tolerance: 10%; Resistance: 10kR; Max Power Dissipation: 500mW; Temperature Coefficient: 100ppm/°C; Insulation Resistance: 1GR; Min Operating Temperature: -55°C; Resistor Type: Cermet; Series: 3296; Color: Blue; Mount: Through Hole; Taper: Linear; Radiation Hardening: No; RoHS Compliant: Yes; Width: 9.53mm; Resistance Tolerance: 10%; Contact Plating: Tin; Military Standard: Not; Package Quantity: 50; Weight: 0.03oz; Lead Free: Lead Free; Power Rating: 500mW; Termination: Pin; Technology: CERMET; Max Operating Temperature: 125°C; Packaging: Rail/Tube; Length: 9.53mm; Depth: 4.83mm; Height: 11.55mm; Reach SVHC Compliant: Yes
R126 R128 = CMP-2001-04106-2: RES Thick Film, 75kΩ, 1%, 0.125W, 100ppm/°C, 0805 / CRCW080575K0FKEA / CRCW080575K0FKEA; Voltage Rating: 150V; Power Rating: 125mW; Resistance: 75kR; Series: CRCW; Packaging: Tape and Reel; Width: 0.049inch; Package Quantity: 10; Max Operating Temperature: 155°C; Height: 0.45mm; Temperature Coefficient: 100ppm/°C; Resistor Type: Thick Film; Case Code (Metric): 2012; RoHS Compliant: Yes; Military Standard: Not; Weight: 0.000194oz; Mount: Surface Mount; Depth: 1.25mm; Max Power Dissipation: 125mW; Tolerance: 1%; Lead Free: Lead Free; Working Voltage: 150V; Technology: THICK FILM; Radiation Hardening: No; Termination: SMD/SMT; Number of Terminations: 2; Number of Pins: 2; Features: Automotive AEC-Q200; Case Code (Imperial): 0805; Resistance Tolerance: 1%; Min Operating Temperature: -55°C; Voltage Rating (DC): 150V; Contact Plating: Tin; Case/Package: 0805; Construction: Rectangular; Length: 2mm
R127 = CMP-2001-03869-2: RES Thick Film, 3kΩ, 1%, 0.125W, 100ppm/°C, 0805 / CRCW08053K00FKEA; Power Rating: 125mW; Working Voltage: 150V; Resistance: 3kR; Features: Automotive AEC-Q200; Military Standard: Not; Case/Package: 0805; Radiation Hardening: No; Packaging: Tape and Reel; Number of Terminations: 2; Depth: 1.25mm; Termination: SMD/SMT; Max Operating Temperature: 155°C; Min Operating Temperature: -55°C; Case Code (Imperial): 0805; Width: 1.25mm; Lead Free: Lead Free; Package Quantity: 10; Voltage Rating (DC): 150V; Temperature Coefficient: 100ppm/°C; Height: 0.45mm; Max Power Dissipation: 125mW; Length: 2mm; Voltage Rating: 150V; Tolerance: 1%; Weight: 0.000194oz; Composition: Thick Film; Case Code (Metric): 2012; Contact Plating: Tin
U100 = CMP-00278-00724779-1: SG3525ADWR2G Voltage Mode PWM Controller 400mA 400kHz 16-Pin SOIC W T/R / IC REG CTRLR PUSH-PULL 16SOIC; NexarPartId: 724779; Manufacturer Lifecycle Status: ACTIVE; Rise Time: 100ns; Max Supply Voltage: 35V; Output Voltage: 18V; Min Supply Voltage: 8V; Max Supply Current: 20mA; Duty Cycle: 49%; Number of Outputs: 2; Fall Time: 50ns; Max Junction Temperature (Tj): 150°C; Max Power Dissipation: 1W; Output Current: 100mA; Min Operating Temperature: 0°C; Height: 2.4mm; REACH SVHC: No SVHC; Schedule B: 8542390000, 8542390000; Lifecycle Status: Production; Frequency: 400kHz; Radiation Hardening: No; Length: 10.45mm; Number of Pins: 16; Lead Free: Lead Free; Width: 7.6mm; Max Duty Cycle: 49%; Ambient Temperature Range High: 70°C; Case/Package: SOIC; Packaging: Digi-Reel®; Nominal Input Voltage: 8V; Halogen Free: Halogen Free; Mount: Surface Mount; Topology: Push-Pull; Max Frequency: 400kHz; RoHS: Compliant; Switching Frequency: 400kHz; Max Operating Temperature: 70°C